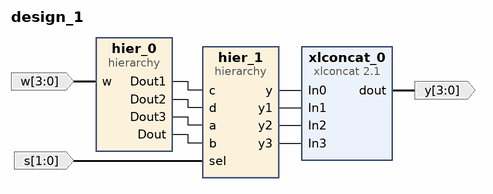
[diagram p0: block diagram of the top level]
# Vivado block design design_1, xc7a100tcsg324-1, Vivado 2024.2
create_bd_design design_1

create_bd_port -dir I -from 1 -to 0 s
create_bd_port -dir I -from 3 -to 0 w
create_bd_port -dir O -from 3 -to 0 y

create_bd_cell -type ip -vlnv xilinx.com:ip:xlconcat:2.1 xlconcat_0
set_property -dict {CONFIG.NUM_PORTS 4} [get_bd_cells xlconcat_0]
create_bd_cell -type hier hier_0
create_bd_cell -type hier hier_1

# ---- hierarchy /hier_0 ----
current_bd_instance /hier_0
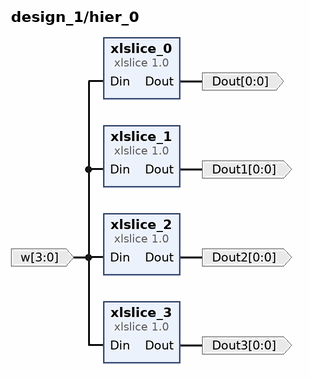
[diagram p1: block diagram inside /hier_0]
create_bd_pin -dir I -from 3 -to 0 w
create_bd_pin -dir O -from 0 -to 0 Dout
create_bd_pin -dir O -from 0 -to 0 Dout1
create_bd_pin -dir O -from 0 -to 0 Dout2
create_bd_pin -dir O -from 0 -to 0 Dout3

create_bd_cell -type ip -vlnv xilinx.com:ip:xlslice:1.0 xlslice_0
set_property -dict {CONFIG.DIN_WIDTH 4} [get_bd_cells xlslice_0]
create_bd_cell -type ip -vlnv xilinx.com:ip:xlslice:1.0 xlslice_1
set_property -dict {CONFIG.DIN_FROM 1 CONFIG.DIN_TO 1 CONFIG.DIN_WIDTH 4} [get_bd_cells xlslice_1]
create_bd_cell -type ip -vlnv xilinx.com:ip:xlslice:1.0 xlslice_2
set_property -dict {CONFIG.DIN_FROM 2 CONFIG.DIN_TO 2 CONFIG.DIN_WIDTH 4} [get_bd_cells xlslice_2]
create_bd_cell -type ip -vlnv xilinx.com:ip:xlslice:1.0 xlslice_3
set_property -dict {CONFIG.DIN_FROM 3 CONFIG.DIN_TO 3 CONFIG.DIN_WIDTH 4} [get_bd_cells xlslice_3]

# ---- hierarchy /hier_1 ----
current_bd_instance /hier_1
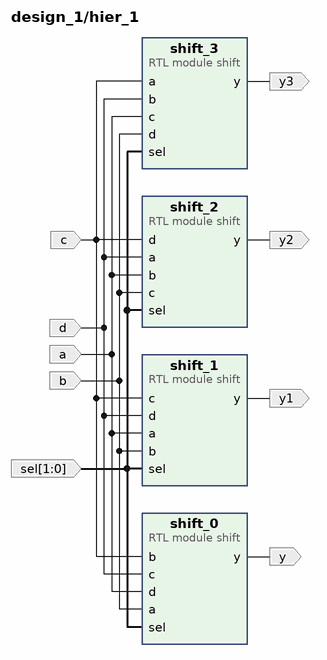
[diagram p2: block diagram inside /hier_1]
create_bd_pin -dir I b
create_bd_pin -dir I c
create_bd_pin -dir I d
create_bd_pin -dir I a
create_bd_pin -dir I -from 1 -to 0 sel
create_bd_pin -dir O y
create_bd_pin -dir O y1
create_bd_pin -dir O y2
create_bd_pin -dir O y3

create_bd_cell -type module -reference shift shift_0
create_bd_cell -type module -reference shift shift_1
create_bd_cell -type module -reference shift shift_2
create_bd_cell -type module -reference shift shift_3

# ---- connections ----

current_bd_instance /hier_0
connect_bd_net [get_bd_pins xlslice_1/Dout] [get_bd_pins Dout1]
connect_bd_net [get_bd_pins xlslice_2/Dout] [get_bd_pins Dout2]
connect_bd_net [get_bd_pins xlslice_3/Dout] [get_bd_pins Dout3]
connect_bd_net -net a_0_1 [get_bd_pins xlslice_0/Dout] [get_bd_pins Dout]
connect_bd_net [get_bd_pins w] [get_bd_pins xlslice_3/Din] [get_bd_pins xlslice_2/Din] [get_bd_pins xlslice_1/Din] [get_bd_pins xlslice_0/Din]

current_bd_instance /hier_1
connect_bd_net [get_bd_pins c] [get_bd_pins shift_1/c] [get_bd_pins shift_2/d] [get_bd_pins shift_3/a] [get_bd_pins shift_0/b]
connect_bd_net [get_bd_pins d] [get_bd_pins shift_1/d] [get_bd_pins shift_2/a] [get_bd_pins shift_3/b] [get_bd_pins shift_0/c]
connect_bd_net [get_bd_pins a] [get_bd_pins shift_1/a] [get_bd_pins shift_2/b] [get_bd_pins shift_3/c] [get_bd_pins shift_0/d]
connect_bd_net -net a_0_1 [get_bd_pins b] [get_bd_pins shift_1/b] [get_bd_pins shift_2/c] [get_bd_pins shift_3/d] [get_bd_pins shift_0/a]
connect_bd_net -net sel_0_1 [get_bd_pins sel] [get_bd_pins shift_1/sel] [get_bd_pins shift_2/sel] [get_bd_pins shift_3/sel] [get_bd_pins shift_0/sel]
connect_bd_net [get_bd_pins shift_0/y] [get_bd_pins y]
connect_bd_net [get_bd_pins shift_1/y] [get_bd_pins y1]
connect_bd_net [get_bd_pins shift_2/y] [get_bd_pins y2]
connect_bd_net [get_bd_pins shift_3/y] [get_bd_pins y3]

current_bd_instance /
connect_bd_net [get_bd_pins hier_0/Dout1] [get_bd_pins hier_1/c]
connect_bd_net [get_bd_pins hier_0/Dout2] [get_bd_pins hier_1/d]
connect_bd_net [get_bd_pins hier_0/Dout3] [get_bd_pins hier_1/a]
connect_bd_net -net a_0_1 [get_bd_pins hier_0/Dout] [get_bd_pins hier_1/b]
connect_bd_net -net sel_0_1 [get_bd_ports s] [get_bd_pins hier_1/sel]
connect_bd_net -net shift_0_y [get_bd_pins hier_1/y] [get_bd_pins xlconcat_0/In0]
connect_bd_net -net shift_1_y [get_bd_pins hier_1/y1] [get_bd_pins xlconcat_0/In1]
connect_bd_net -net shift_2_y [get_bd_pins hier_1/y2] [get_bd_pins xlconcat_0/In2]
connect_bd_net -net shift_3_y [get_bd_pins hier_1/y3] [get_bd_pins xlconcat_0/In3]
connect_bd_net [get_bd_ports w] [get_bd_pins hier_0/w]
connect_bd_net [get_bd_pins xlconcat_0/dout] [get_bd_ports y]

validate_bd_design
save_bd_design
